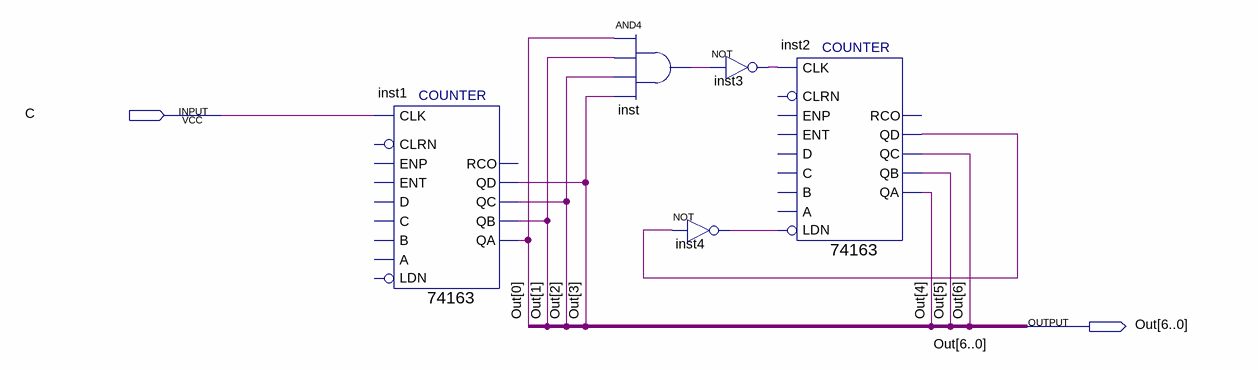
[diagram p0: schematic sheet]
// Quartus schematic Counter8.bdf as structural Verilog: 5 symbols, 2 pins
module Counter8 (
  input  C,
  output [6:0] Out
);

  wire inst2_qd, inst3_out, inst4_out, inst_out;

  \74163  inst1 (
    .CLK(C), .QA(Out[0]), .QB(Out[1]), .QC(Out[2]), .QD(Out[3]));  // open: C, B, A, ENT, D, CLRN, ENP, LDN, RCO
  and inst (inst_out, Out[0], Out[1], Out[2], Out[3]);
  not inst4 (inst4_out, inst2_qd);
  not inst3 (inst3_out, inst_out);
  \74163  inst2 (
    .CLK(inst3_out), .LDN(inst4_out), .QA(Out[4]), .QB(Out[5]), .QC(Out[6]), .QD(inst2_qd));  // open: C, B, A, ENT, D, CLRN, ENP, RCO
endmodule
